# EAGLE schematic stewduino (EAGLE 8.5.0)
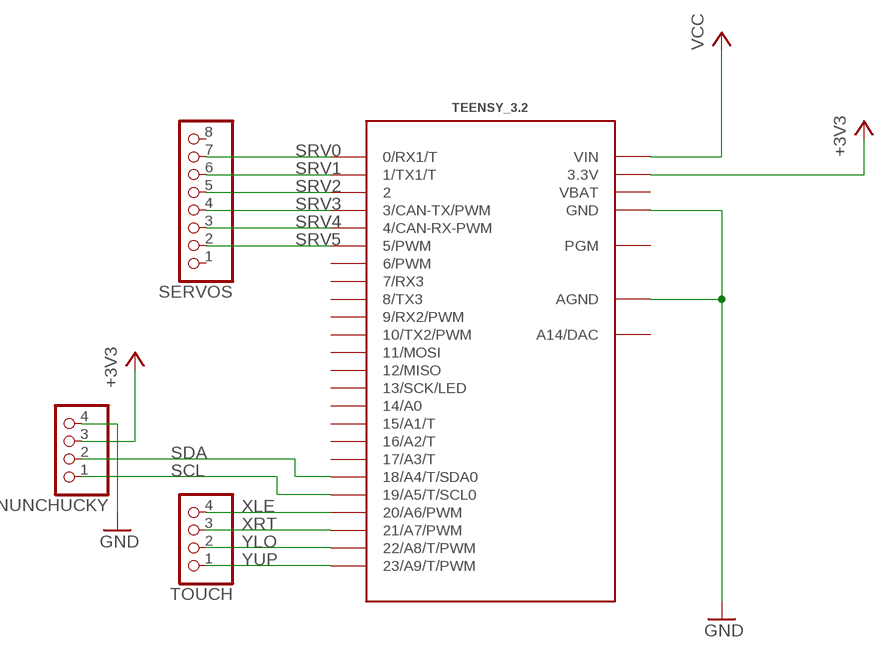
[diagram p0: schematic, sheet 1]

## Parts
NUNCHUCKY  PINHD-1X4  [1X04]
SERVOS  PINHD-1X8  [1X08]
TEENSY_3.2  TEENSY_3.1-3.2_OUTER_ROW  [TEENSY_3.0-3.2&LC_OUTER_ROW]
TOUCH  PINHD-1X4  [1X04]

## Nets
+3V3: NUNCHUCKY.3 TEENSY_3.2.3.3V TEENSY_3.2.3.3V1(3.3V)
GND: NUNCHUCKY.4 TEENSY_3.2.AGND TEENSY_3.2.GND TEENSY_3.2.GND1(GND)
SCL: NUNCHUCKY.1 TEENSY_3.2.19/A5(19/A5/T/SCL0)
SDA: NUNCHUCKY.2 TEENSY_3.2.18/A4(18/A4/T/SDA0)
SRV0: SERVOS.7 TEENSY_3.2.0(0/RX1/T)
SRV1: SERVOS.6 TEENSY_3.2.1(1/TX1/T)
SRV2: SERVOS.5 TEENSY_3.2.2
SRV3: SERVOS.4 TEENSY_3.2.3(3/CAN-TX/PWM)
SRV4: SERVOS.3 TEENSY_3.2.4(4/CAN-RX-PWM)
SRV5: SERVOS.2 TEENSY_3.2.5(5/PWM)
VCC: TEENSY_3.2.VIN
XLE: TEENSY_3.2.20/A6(20/A6/PWM) TOUCH.4
XRT: TEENSY_3.2.21/A7(21/A7/PWM) TOUCH.3
YLO: TEENSY_3.2.22/A8(22/A8/T/PWM) TOUCH.2
YUP: TEENSY_3.2.23/A9(23/A9/T/PWM) TOUCH.1
Unconnected: SERVOS.1 SERVOS.8 TEENSY_3.2.6(6/PWM) TEENSY_3.2.7(7/RX3) TEENSY_3.2.8(8/TX3) TEENSY_3.2.9(9/RX2/PWM) TEENSY_3.2.10(10/TX2/PWM) TEENSY_3.2.11(11/MOSI) TEENSY_3.2.12(12/MISO) TEENSY_3.2.13(13/SCK/LED) TEENSY_3.2.14/A0 TEENSY_3.2.15/A1(15/A1/T) TEENSY_3.2.16/A2(16/A2/T) TEENSY_3.2.17/A3(17/A3/T) TEENSY_3.2.PGM TEENSY_3.2.RESET/DAC(A14/DAC)

## Power pins joined to a net without a drawn wire
VBAT: TEENSY_3.2.VBAT

## Library data of the parts
NUNCHUCKY TOUCH = pinhead:PINHD-1X4: PIN HEADER
SERVOS = pinhead:PINHD-1X8: PIN HEADER
TEENSY_3.2 = Teensy_3_and_LC_Series_Boards_v1.4:TEENSY_3.1-3.2_OUTER_ROW: Footprint for Teensy 3.1 or 3.2 board using all pin connections on the outer perimeter